# Altium schematic sheet SCH-10-Power Connectors_copy.SchDoc
size A
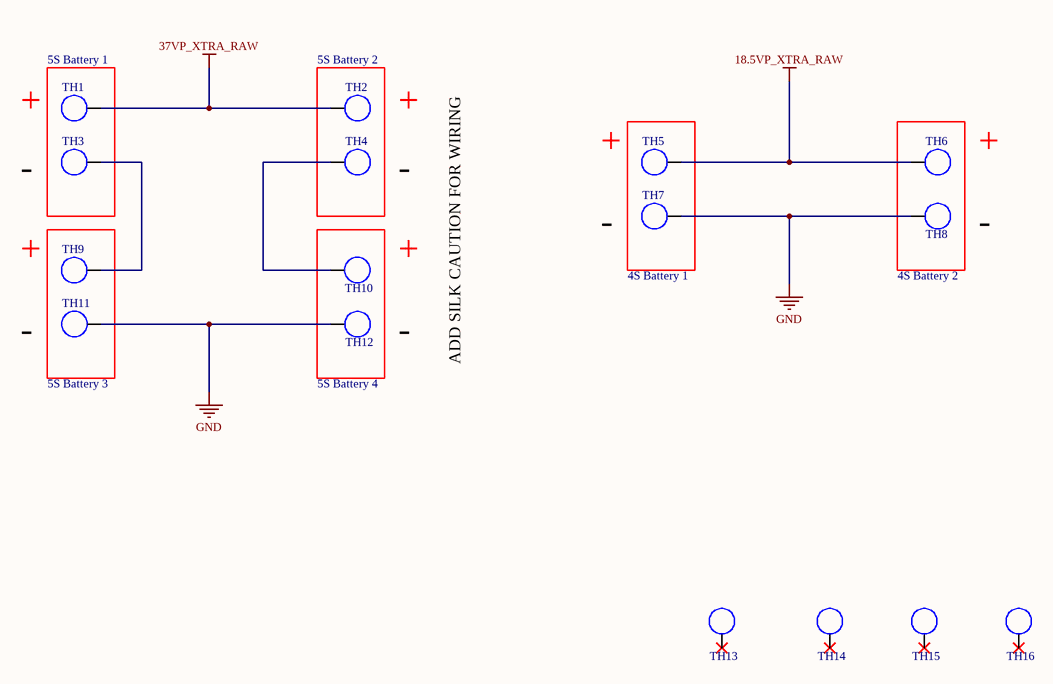
[diagram p0: SCH-10-Power Connectors_copy.SchDoc]

## Parts
TH1  12AWG_TH  [m3screw]  (value not drawn)
TH2  12AWG_TH  [m3screw]  (value not drawn)
TH3  12AWG_TH  [m3screw]  (value not drawn)
TH4  12AWG_TH  [m3screw]  (value not drawn)
TH5  10AWG_TH  [m3screw]  (value not drawn)
TH6  10AWG_TH  [m3screw]  (value not drawn)
TH7  10AWG_TH  [m3screw]  (value not drawn)
TH8  10AWG_TH  [m3screw]  (value not drawn)
TH9  10AWG_TH  [m3screw]  (value not drawn)
TH10  10AWG_TH  [m3screw]  (value not drawn)
TH11  10AWG_TH  [m3screw]  (value not drawn)
TH12  10AWG_TH  [m3screw]  (value not drawn)
TH13  10AWG_TH  [m3screw]  (value not drawn)
TH14  10AWG_TH  [m3screw]  (value not drawn)
TH15  10AWG_TH  [m3screw]  (value not drawn)
TH16  10AWG_TH  [m3screw]  (value not drawn)

## Blocks framed on the sheet
5S Battery 1: TH1 TH3
5S Battery 2: TH2 TH4

## Nets
18.5VP_XTRA_RAW: TH5.1 TH6.1
37VP_XTRA_RAW: TH1.1 TH2.1
GND: TH7.1 TH8.1 TH11.1 TH12.1
NetTH3_1: TH3.1 TH9.1
NetTH4_1: TH4.1 TH10.1

Not connected (* = marked no-connect by the designer): TH13 1*; TH14 1*; TH15 1*; TH16 1*

## Notes on the sheet
- +
- -
- (near TH7) 4S Battery 1
- (near TH8) 4S Battery 2
- ADD SILK CAUTION FOR WIRING
- 5S Battery 3
- (near TH12) 5S Battery 4